# EAGLE design a405-diode-distortion (EAGLE 7.5.1)
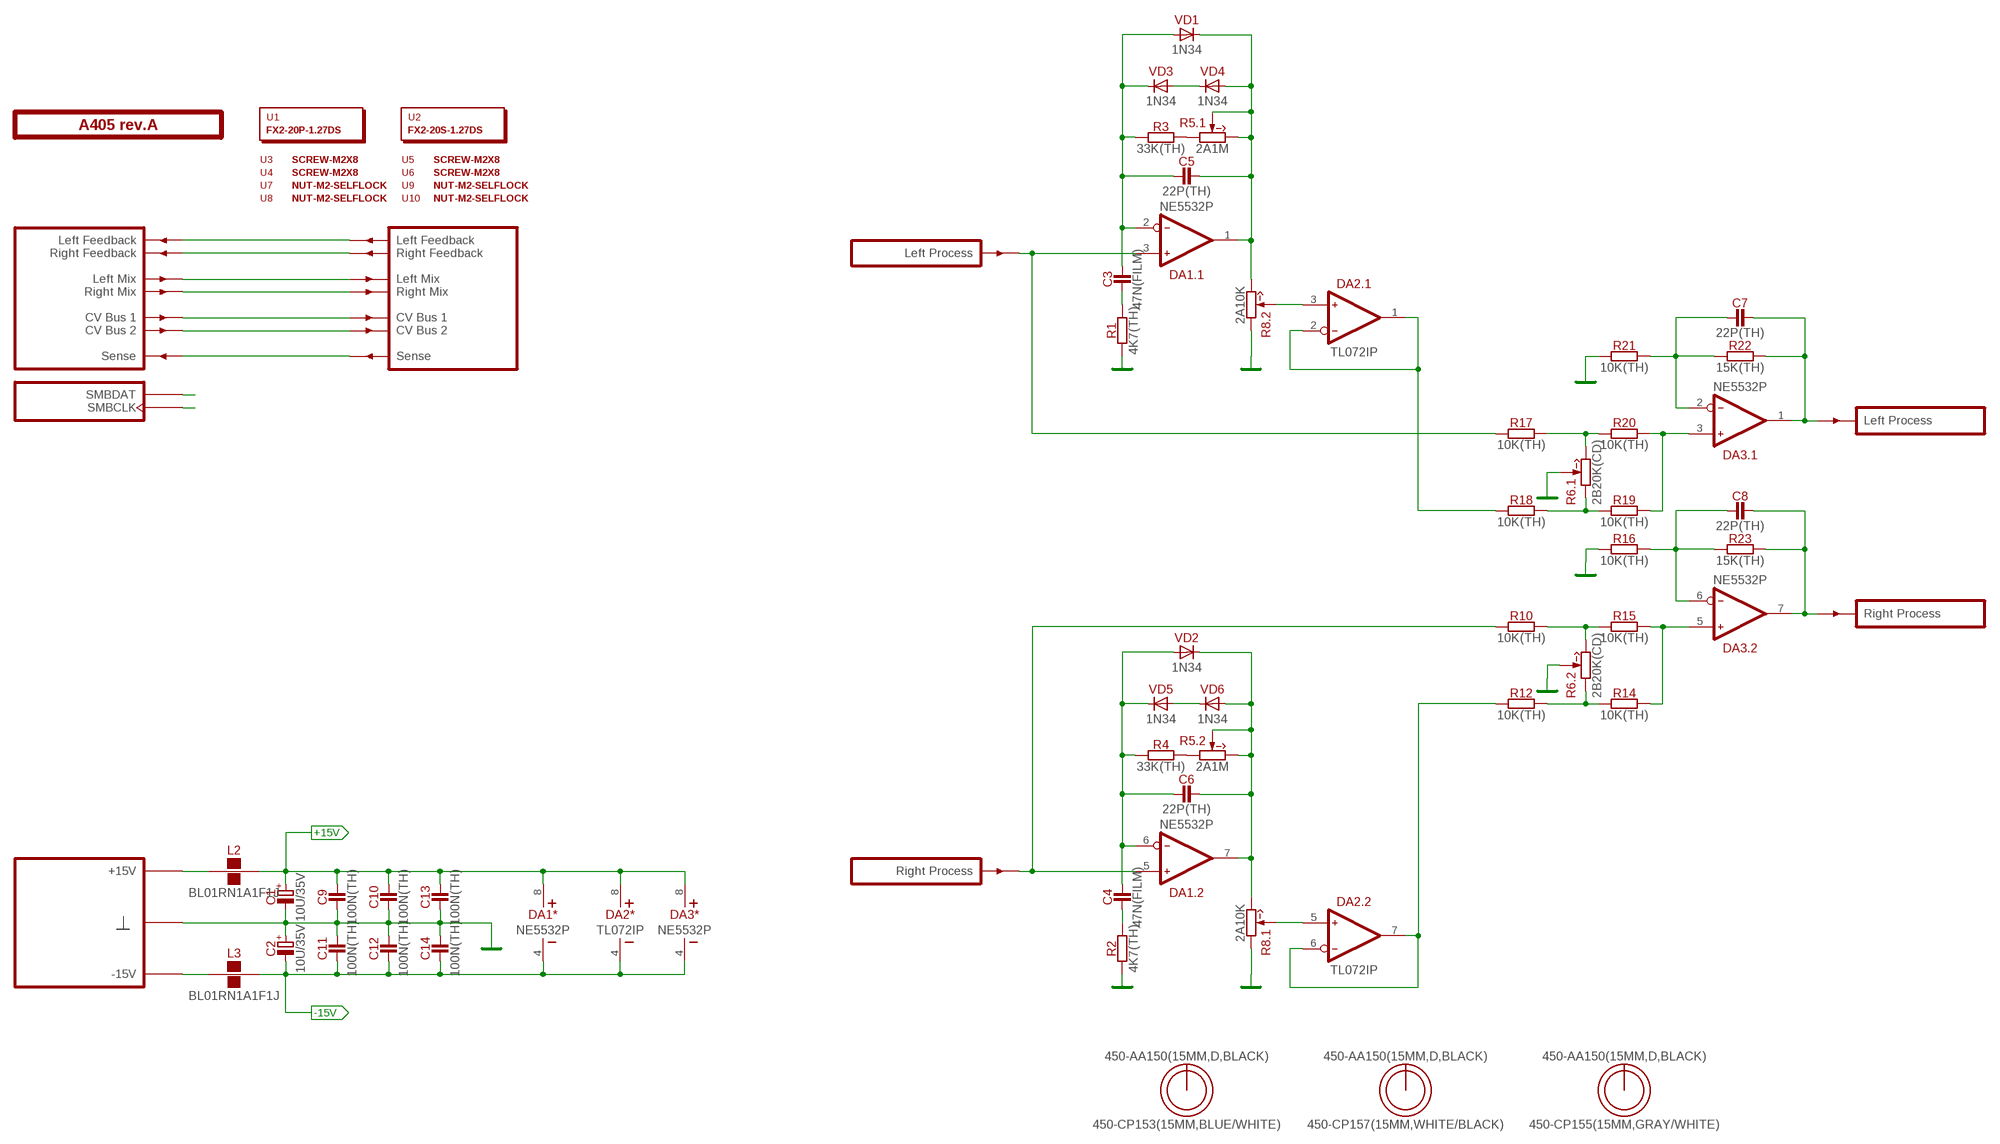
[diagram p0: schematic, sheet 1]

## Parts
C1  10U/35V  [E2-5]
C2  10U/35V  [E2-5]
C3  47N(FILM)  [C050-025X075]
C4  47N(FILM)  [C050-025X075]
C5  22P(TH)  [C050-024X044]
C6  22P(TH)  [C050-024X044]
C7  22P(TH)  [C050-024X044]
C8  22P(TH)  [C050-024X044]
C9  100N(TH)  [C050-024X044]
C10  100N(TH)  [C050-024X044]
C11  100N(TH)  [C050-024X044]
C12  100N(TH)  [C050-024X044]
C13  100N(TH)  [C050-024X044]
C14  100N(TH)  [C050-024X044]
DA1  NE5532P  [DIP-8]
DA2  TL072IP  [DIP-8]
DA3  NE5532P  [DIP-8]
L2  BL01RN1A1F1J  [BL01RN1A]
L3  BL01RN1A1F1J  [BL01RN1A]
O2  450-AA150(15MM,D,BLACK)  [EMPTY]
O3  450-AA150(15MM,D,BLACK)  [EMPTY]
O4  450-AA150(15MM,D,BLACK)  [EMPTY]
O5  450-CP155(15MM,GRAY/WHITE)  [EMPTY]
O6  450-CP157(15MM,WHITE/BLACK)  [EMPTY]
O7  450-CP153(15MM,BLUE/WHITE)  [EMPTY]
PCB1  A405 rev.A  ST2-BOARD-50  [ST2-BOARD-50]
R1  4K7(TH)  [R-0207/10]
R2  4K7(TH)  [R-0207/10]
R3  33K(TH)  [R-0207/10]
R4  33K(TH)  [R-0207/10]
R5  2A1M  [RV11-DUAL]
R6  2B20K(CD)  [RV11-DUAL]
R8  2A10K  [RV11-DUAL]
R10  10K(TH)  [R-0207/10]
R12  10K(TH)  [R-0207/10]
R14  10K(TH)  [R-0207/10]
R15  10K(TH)  [R-0207/10]
R16  10K(TH)  [R-0207/10]
R17  10K(TH)  [R-0207/10]
R18  10K(TH)  [R-0207/10]
R19  10K(TH)  [R-0207/10]
R20  10K(TH)  [R-0207/10]
R21  10K(TH)  [R-0207/10]
R22  15K(TH)  [R-0207/10]
R23  15K(TH)  [R-0207/10]
U1  FX2-20P-1.27DS  [EMPTY]
U2  FX2-20S-1.27DS  [EMPTY]
U3  SCREW-M2X8  [EMPTY]
U4  SCREW-M2X8  [EMPTY]
U5  SCREW-M2X8  [EMPTY]
U6  SCREW-M2X8  [EMPTY]
U7  NUT-M2-SELFLOCK  [EMPTY]
U8  NUT-M2-SELFLOCK  [EMPTY]
U9  NUT-M2-SELFLOCK  [EMPTY]
U10  NUT-M2-SELFLOCK  [EMPTY]
VD1  1N34  [DO35-15]
VD2  1N34  [DO35-15]
VD3  1N34  [DO35-15]
VD4  1N34  [DO35-15]
VD5  1N34  [DO35-15]
VD6  1N34  [DO35-15]

## Nets
+15V [power]: C1.+ C9.2 C10.2 C13.2 DA1.8(*:V+) DA2.8(*:V+) DA3.8(*:V+) L2.2
-15V [power]: C2.- C11.1 C12.1 C14.1 DA1.4(*:V-) DA2.4(*:V-) DA3.4(*:V-) L3.2
FBK_LEFT: PCB1.ALFBK'(LFBK') PCB1.ALFBK(LFBK)
FBK_RIGHT: PCB1.ARFBK'(RFBK') PCB1.ARFBK(RFBK)
GND: C1.- C2.+ C9.1 C10.1 C11.2 C12.2 C13.1 C14.2 PCB1.B4'(GND) PCB1.B4(GND) PCB1.B5'(GND) PCB1.B5(GND) PCB1.B6'(GND) PCB1.B6(GND) PCB1.B7'(GND) PCB1.B7(GND) PCB1.B8'(GND) PCB1.B8(GND) R1.1 R2.1 R6.2'(.2:W) R6.2(.1:W) R8.1'(.2:CCW) R8.1(.1:CCW) R16.1 R21.1
LMIX: PCB1.ALMIX'(LMIX') PCB1.ALMIX(LMIX)
N$1: R3.2 R5.1(.1:CCW)
N$2: R4.2 R5.1'(.2:CCW)
N$3: C7.2 DA3.1(.1:OUT) PCB1.BOUTL'(OUTL) R22.2
N$4: C3.1 R1.2
N$5: R6.3(.1:CW) R17.2 R20.1
N$6: DA1.5(.2:IN+) PCB1.BINR(INR) R10.1
N$7: C6.2 DA1.7(.2:OUT) R5.2'(.2:W) R5.3'(.2:CW) R8.3(.1:CW) VD2.C VD6.A
N$8: C4.1 R2.2
N$9: C5.2 DA1.1(.1:OUT) R5.2(.1:W) R5.3(.1:CW) R8.3'(.2:CW) VD1.C VD4.A
N$10: C4.2 C6.1 DA1.6(.2:IN-) R4.1 VD2.A VD5.C
N$11: C8.1 DA3.6(.2:IN-) R16.2 R23.1
N$12: DA3.5(.2:IN+) R14.2 R15.2
N$13: DA3.3(.1:IN+) R19.2 R20.2
N$14: VD3.A VD4.C
N$15: R6.1'(.2:CCW) R12.2 R14.1
N$16: PCB1.BSENSE'(SENSE') PCB1.BSENSE(SENSE)
N$17: C3.2 C5.1 DA1.2(.1:IN-) R3.1 VD1.A VD3.C
N$18: DA1.3(.1:IN+) PCB1.BINL(INL) R17.1
N$19: C8.2 DA3.7(.2:OUT) PCB1.BOUTR'(OUTR) R23.2
N$20: VD5.A VD6.C
N$23: DA2.5(.2:IN+) R8.2(.1:W)
N$24: DA2.6(.2:IN-) DA2.7(.2:OUT) R12.1
N$26: DA2.3(.1:IN+) R8.2'(.2:W)
N$27: DA2.1(.1:OUT) DA2.2(.1:IN-) R18.1
N$36: L3.1 PCB1.A-15'(P-15V) PCB1.A-15(P-15V) PCB1.B-15'(P-15V) PCB1.B-15(P-15V)
N$38: PCB1.ASMBDAT'(SMBDAT) PCB1.ASMBDAT(SMBDAT)
N$41: PCB1.ACV1'(CV1') PCB1.ACV1(CV1)
N$42: PCB1.ACV2'(CV2') PCB1.ACV2(CV2)
N$43: PCB1.ASMBCLK'(SMBCLK) PCB1.ASMBCLK(SMBCLK)
N$50: R6.1(.1:CCW) R18.2 R19.1
N$59: R6.3'(.2:CW) R10.2 R15.1
N$64: C7.1 DA3.2(.1:IN-) R21.2 R22.1
P+15V: L2.1 PCB1.A+15'(P+15V) PCB1.A+15(P+15V) PCB1.B+15'(P+15V) PCB1.B+15(P+15V)
RMIX: PCB1.ARMIX'(RMIX') PCB1.ARMIX(RMIX)

## Library data of the parts
C1 C2 = capacitors-electrolytic:?; MOUSER: 647-USW1V100MDD
C3 C4 = capacitors:?; MOUSER: 871-B32529C1473J
C5-C8 = capacitors:?
C9-C14 = capacitors:?; MOUSER: 81-RCER71H104K0A2H3B
DA1 DA3 = ic-ti:NE5532; MOUSER: 595-SA5532AP
DA2 = ic-ti:TL072; MOUSER: 595-TL072IP
L2 L3 = inductors:BL01RN1A?; MOUSER: 81-BL01RN1A1F1J
O2-O4 = hardware:450-AA?; MOUSER: 450-AA150
O5 = hardware:450-C?; MOUSER: 450-CP155
O6 = hardware:450-C?; MOUSER: 450-CP157
O7 = hardware:450-C?; MOUSER: 450-CP153
PCB1 = module-footprints:ST2-BOARD-?
R1-R4 R22 R23 = resistors:?
R5 = potentiometers:2**?; MOUSER: 317-2102F-1M
R6 = potentiometers:2**?; MOUSER: 688-RK12L1230C1M
R8 = potentiometers:2**?; MOUSER: 688-RK12L12C0A0E
R10 R12 R14-R21 = resistors:?; MOUSER: 71-RN55D-F-10K
U1 = hardware:?; MOUSER: 798-FX2-20P-1.27DS71
U2 = hardware:?; MOUSER: 798-FX2-20S-1.27DS71
U3-U10 = hardware:*?
VD1-VD6 = diodes:?

## Board
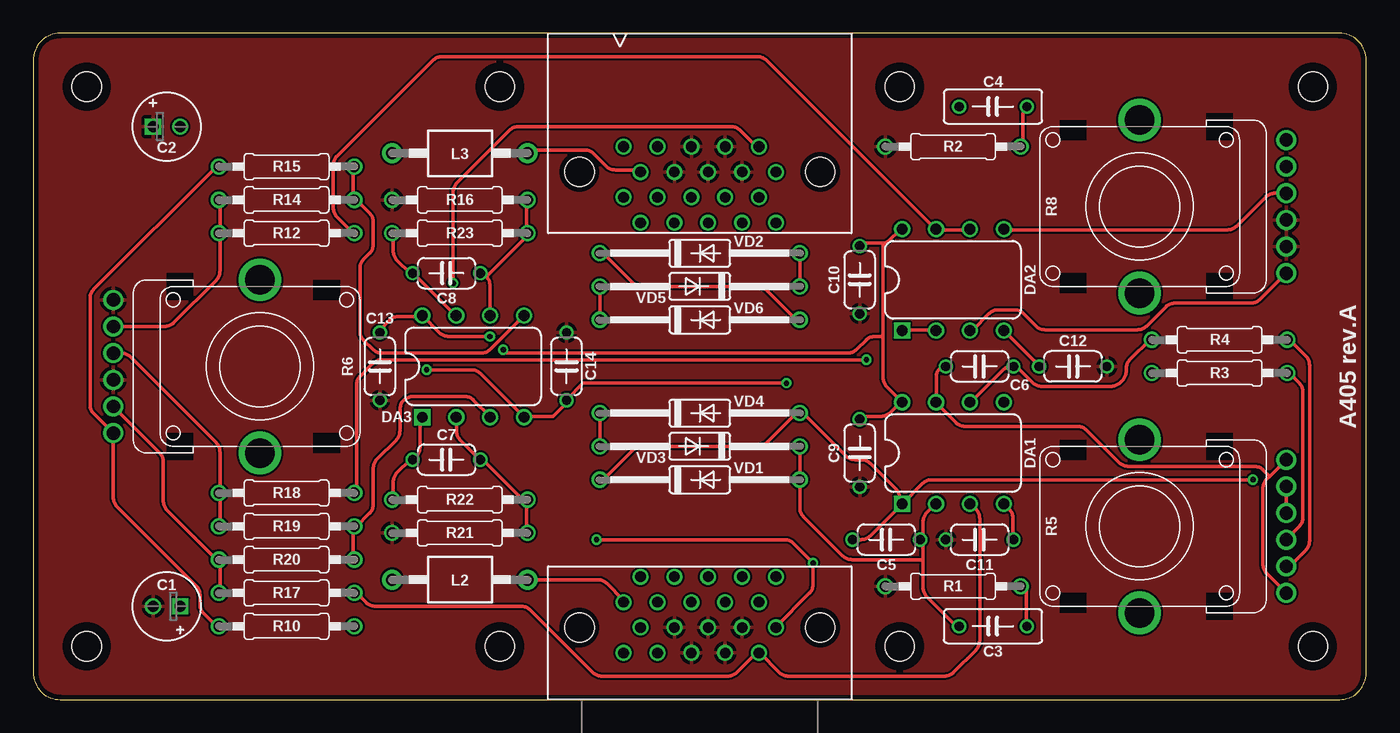
[diagram p1: board, top side]
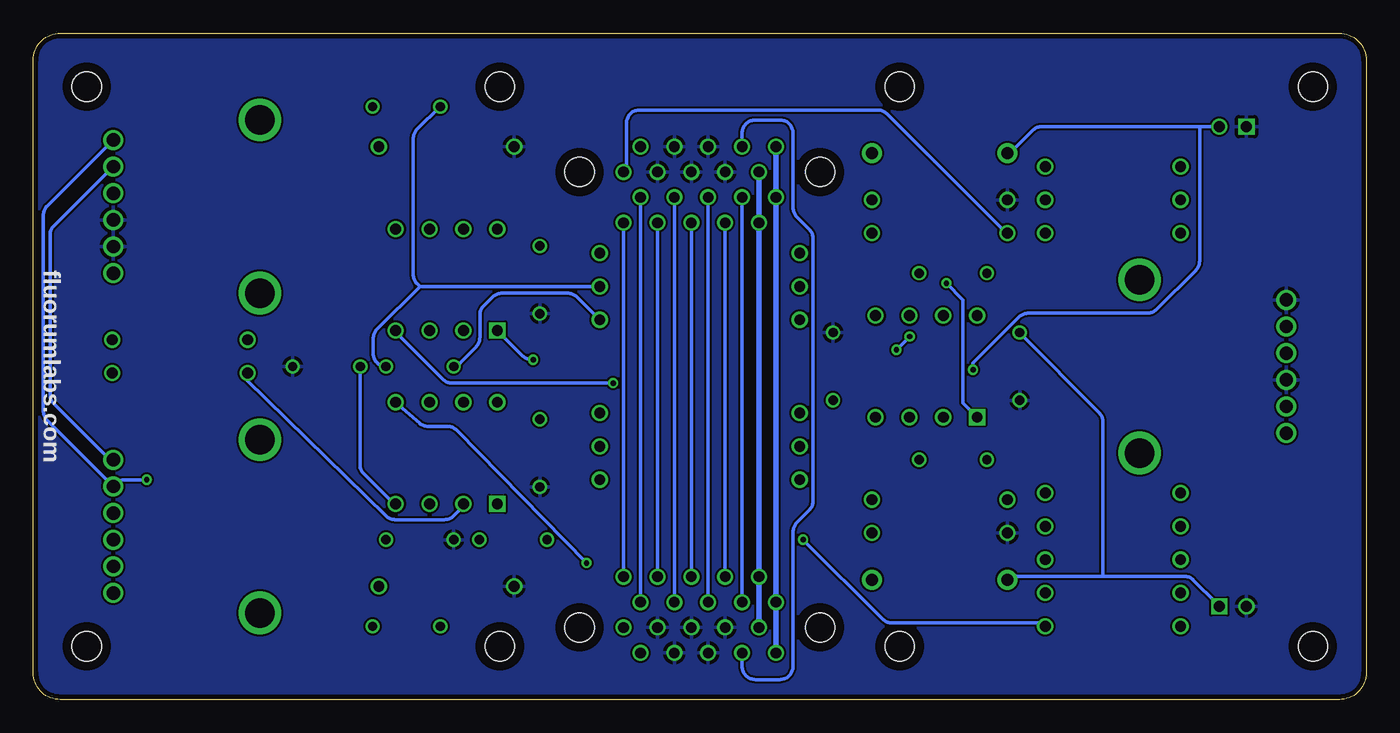
[diagram p2: board, bottom side, seen from below]

Size 100 x 50 mm. Coordinates in mm from the lower left corner, seen from the top.
Outline: 0,48 0,2 arc90 2,0 98,0 arc90 100,2 100,48 arc90 98,50 2,50 arc90 0,48
Copper layers (1*16): Top 0.0356mm / dielectric 1.5011mm / Bottom 0.0356mm
Design rules "sonictrain": minimum track width 6mil, minimum drill 13mil, track to track 6mil, track to pad 6mil, pad to pad 6mil, via to via 6mil, smd to smd 6mil, copper to edge 15mil, drill to drill 6mil, minimum pad ring 7mil, minimum via ring 7mil, stop-mask expansion 3mil, vias tented up to drill 0mil, thermal gap 10mil

### Footprints (pad centres in the part's own frame; a part is rotated, then mirrored left to right if it is on the bottom)
E2-5 = drill 0.813 square: + -1.016,0 | drill 0.813: - 1.016,0
C050-025X075 = drill 0.7: 1 -2.54,0; 2 2.54,0
C050-024X044 = drill 0.7: 1 -2.54,0; 2 2.54,0
DIP-8 = drill 0.813 square: 1 -3.81,-3.81 | drill 0.813: 2 -1.27,-3.81; 3 1.27,-3.81; 4 3.81,-3.81; 5 3.81,3.81; 6 1.27,3.81; 7 -1.27,3.81; 8 -3.81,3.81
BL01RN1A = drill 0.9 pad 1.5: 1 -5.08,0; 2 5.08,0
ST2-BOARD-50 = drill 0.8: A+15 44.285,7.31; A+15' 44.285,37.69; A-15 45.555,9.215; A-15' 45.555,35.785; ACV1 51.905,7.31; ACV1' 51.905,37.69; ACV2 53.175,9.215; ACV2' 53.175,35.785; ALFBK 49.365,7.31; ALFBK' 49.365,37.69; ALMIX 46.825,7.31; ALMIX' 46.825,37.69; ARFBK 50.635,9.215; ARFBK' 50.635,35.785; ARMIX 48.095,9.215; ARMIX' 48.095,35.785; ASMBCLK 55.715,9.215; ASMBCLK' 55.715,35.785; ASMBDAT 54.445,7.31; ASMBDAT' 54.445,37.69; B4 48.095,5.405; B4' 48.095,39.595; B5 49.365,3.5; B5' 49.365,41.5; B6 50.635,5.405; B6' 50.635,39.595; B7 51.905,3.5; B7' 51.905,41.5; B8 53.175,5.405; B8' 53.175,39.595; B+15 44.285,3.5; B+15' 44.285,41.5; B-15 45.555,5.405; B-15' 45.555,39.595; BINL 54.445,3.5; BINR 55.715,5.405; BOUTL' 54.445,41.5; BOUTR' 55.715,39.595; BSENSE 46.825,3.5; BSENSE' 46.825,41.5 | hole 2.2: 4,4; 4,46; 96,4; 96,46; 35,46; 65,46; 65,4; 35,4; 59.025,5.405; 40.975,5.405; 40.975,39.595; 59.025,39.595
R-0207/10 = drill 0.813: 1 -5.08,0; 2 5.08,0
RV11-DUAL = drill 1: 1 -1,-11; 1' -3,-11; 2 1,-11; 2' -5,-11; 3 3,-11; 3' 5,-11 | drill 2.2: S1 -6.5,0; S2 6.5,0
DO35-15 = drill 0.813: A 7.5,0; C -7.5,0

### Placement (x,y rotation side)
C1  10,7 180 top
C2  10,43 0 top
C3  72,5.5 180 top
C4  72,44.5 180 top
C5  64,12 180 top
C6  71,25 180 top
C7  31,18 180 top
C8  31,32 180 top
C9  62,18.5 90 top
C10  62,31.5 90 top
C11  71,12 180 top
C12  78,25 0 top
C13  26,25 90 top
C14  40,25 90 top
DA1  69,18.5 0 top
DA2  69,31.5 0 top
DA3  33,25 0 top
L2  32,9 180 top
L3  32,41 180 top
O2  -8,-100.25 0 top  (outside the outline)
O3  -9,-101.5 0 top  (outside the outline)
O4  -10,-102.75 0 top  (outside the outline)
O5  -11,-104 0 top  (outside the outline)
O6  -12,-105.25 0 top  (outside the outline)
O7  -13,-106.5 0 top  (outside the outline)
PCB1  0,0 0 top
R1  69,8.5 0 top
R2  69,41.5 0 top
R3  89,24.5 0 top
R4  89,27 0 top
R5  2*A1M  [RV11-DUAL]  83,13 90 top
R6  2*B20K(CD)  [RV11-DUAL]  17,25 270 top
R8  2*A10K  [RV11-DUAL]  83,37 90 top
R10  19,5.5 180 top
R12  19,35 180 top
R14  19,37.5 0 top
R15  19,40 0 top
R16  32,37.5 0 top
R17  19,8 180 top
R18  19,15.5 180 top
R19  19,13 0 top
R20  19,10.5 0 top
R21  32,12.5 0 top
R22  32,15 180 top
R23  32,35 180 top
U1  83,-99 0 top  (outside the outline)
U2  86,-99 0 top  (outside the outline)
U3  -14,-107.75 0 top  (outside the outline)
U4  -15,-109 0 top  (outside the outline)
U5  -16,-110.25 0 top  (outside the outline)
U6  -17,-111.5 0 top  (outside the outline)
U7  -18,-112.75 0 top  (outside the outline)
U8  -19,-114 0 top  (outside the outline)
U9  -20,-115.25 0 top  (outside the outline)
U10  -21,-116.5 0 top  (outside the outline)
VD1  50,16.5 0 top
VD2  50,33.5 0 top
VD3  50,19 180 top
VD4  50,21.5 0 top
VD5  50,31 180 top
VD6  50,28.5 0 top

### Tracks (layer width: path | path; a pad name or v marks a point on that pad's centre or on a via)
+15V  (via drill 0.4)
  Top 0.254: 63.75,34.25 arc45 64.18,34.43 65,35.25 DA2.8 | 63.75,34.25 62,34.25 C10.2 | C9.2 62,21.25 63.59,21.25 arc45 64.29,21.54 65,22.25 DA1.8 64.04,23.46 arc-45 63.75,24.16 63.75,27.25 | C13.2 26,27.75 26.71,28.46 arc-45 27.41,28.75 29,28.75 DA3.8 30.46,27.54 arc45 31.16,27.25 v34.25,27.25 | 63.75,34.25 63.75,27.25 | 63.75,27.25 63.16,27.25 arc45 62.46,26.96 61.79,26.29 arc-45 61.09,26 35.5,26 v35.25,26.25
  Bottom 0.254: L2.2 26.75,9 26.5,9.25 19.75,9.25 | 19.75,9.25 13.66,9.25 arc45 12.96,8.96 11.25,7.25 C1.+ | v34.25,27.25 v35.25,26.25 | 19.75,9.25 19.75,20.84 arc-45 20.04,21.54 26,27.5 C13.2
-15V  (via drill 0.4)
  Top 0.254: DA1.4 73.21,14.29 arc-45 73.5,13.59 73.5,12 C11.1 | DA2.4 75.25,25.25 75.25,25 C12.1 | v56.5,23.75 41.25,23.75 40,22.5 C14.1 40,22.25 39,21.25 37,21.25 DA3.4 33.54,24.46 arc45 32.84,24.75 v29.5,24.75
  Bottom 0.254: DA1.4 73,14.75 75.21,16.96 arc45 75.5,17.66 75.5,25 C12.1 | 12.5,43 24.34,43 arc-45 25.04,42.71 26.75,41 L3.2 | 12.5,43 C2.- | v56.5,23.75 68.59,23.75 arc45 69.29,24.04 72.75,27.5 DA2.4 | v29.5,24.75 29.5,25.25 26.04,28.71 arc45 25.34,29 16.41,29 arc-45 15.71,29.29 12.79,32.21 arc-45 12.5,32.91 12.5,43
FBK_LEFT
  Bottom 0.254: PCB1.ALFBK' PCB1.ALFBK
FBK_RIGHT
  Bottom 0.254: PCB1.ARFBK PCB1.ARFBK'
GND
  pour Bottom: 98,0 2,0 arc-90 0,2 0,48 arc-90 2,50 98,50 arc-90 100,48 100,2 arc-90
  pour Top: 98,0 2,0 arc-90 0,2 0,48 arc-90 2,50 98,50 arc-90 100,48 100,2 arc-90
LMIX
  Bottom 0.254: PCB1.ALMIX' PCB1.ALMIX
N$1
  Top 0.254: R5.1 94.96,12.96 arc45 95.25,13.66 95.25,23.09 arc45 94.96,23.79 94.25,24.5 R3.2
N$2
  Top 0.254: R5.1' 94.25,10 95.46,11.21 arc45 95.75,11.91 95.75,25.09 arc45 95.46,25.79 94.25,27 R4.2
N$3  (via drill 0.4)
  Top 0.254: DA3.1 29,21 29,18.91 arc-45 28.71,18.21 28.5,18 C7.2 28.25,18 27.29,17.04 arc45 27,16.34 27,15 R22.2 | v31.5,31.25 31.5,38.09 arc-45 31.79,38.79 35.71,42.71 arc-45 36.41,43 52.34,43 arc-45 53.04,42.71 54.25,41.5 PCB1.BOUTL'
  Bottom 0.254: v31.5,31.25 30.25,30 30.25,22.25 DA3.1
N$4
  Top 0.254: C3.1 74.5,5.5 74.5,8.25 74.25,8.5 R1.2
N$5
  Top 0.254: R17.2 14,8 14,10.5 R20.1 13.75,10.5 10.04,14.21 arc-45 9.75,14.91 9.75,17.84 arc45 9.46,18.54 R6.3
N$6  (via drill 0.4)
  Top 0.254: PCB1.BINR 55.75,5.5 58.21,7.96 arc45 58.5,8.66 v58.5,10.25 57.04,11.71 arc45 56.34,12 v42.25,12
  Bottom 0.254: v58.5,10.25 68.21,20.2 arc-46 68.92,20.5 70.37,20.5 arc41 71.03,20.75 DA1.5 | v42.25,12 36.29,6.04 arc-45 35.59,5.75 24.5,5.75 24.25,5.5 R10.1
N$7
  Top 0.254: C6.2 arc90 67.75,24.29 67.75,22.5 DA1.7 67.75,22.25 69.21,20.79 arc45 69.91,20.5 78.34,20.5 arc-45 79.04,20.21 81.46,17.79 arc45 82.16,17.5 91.59,17.5 arc-45 92.29,17.21 92.75,16.75 | R5.2' 92.54,9.46 arc-45 92.25,10.16 92.25,15.84 arc-45 92.54,16.54 92.75,16.75 | R5.3' 92.75,16.75 | VD2.C 42.75,33.5 44.96,31.29 arc45 45.66,31 54.34,31 arc-45 55.04,30.71 57.25,28.5 VD6.A
  Bottom 0.254: R8.3 98.46,35.54 arc-45 98.75,34.84 98.75,22.91 arc-45 98.46,22.21 94.25,18 R5.3' | VD6.A 59.21,30.21 arc-45 59.91,30.5 64.84,30.5 arc-45 65.54,30.21 66.21,29.54 arc-45 66.5,28.84 66.5,27.16 arc45 66.79,26.46 68.25,25 C6.2
N$8
  Top 0.254: R2.2 74.25,41.5 74.25,43.9 arc-45 74.5,44.5 C4.1
N$9  (via drill 0.4)
  Top 0.254: DA1.1 62.79,12.29 arc-45 62.09,12 C5.2 | R5.2 R5.3 | DA1.1 65,14.75 65,15.09 arc45 64.71,15.79 62.79,17.71 arc45 62.09,18 61.66,18 arc-45 60.96,18.29 57.75,21.5 VD4.A 57.25,21.5 55.04,19.29 arc-45 54.34,19 45.66,19 arc45 44.96,18.71 42.75,16.5 VD1.C | DA1.1 66.71,16.21 arc-45 67.41,16.5 v91.5,16.5
  Bottom 0.254: R8.3' 98.96,37.04 arc-45 99.25,36.34 99.25,21.66 arc-45 98.96,20.96 R5.3 93.79,16.21 arc45 93.09,16.5 v91.5,16.5
N$10
  Top 0.254: DA1.6 70.5,22.5 72.71,24.71 arc-45 73.41,25 C6.1 73.75,25 74.96,23.79 arc45 75.66,23.5 80.84,23.5 arc45 81.54,23.79 81.71,23.96 arc45 82,24.66 82,24.84 arc-45 82.29,25.54 83.75,27 R4.1 | VD2.A VD5.C
  Bottom 0.254: C6.1 arc90 74.5,25.96 74.5,27.09 arc45 74.21,27.79 71,31 | VD5.C 71,31 | 71,31 71.21,31.21 arc45 71.5,31.91 71.5,42.09 arc45 71.21,42.79 69.5,44.5 C4.2
N$11
  Top 0.254: 34,31.75 arc-45 34.25,31.15 34.25,29 DA3.6 | 34,31.75 33.75,32 C8.1 34,31.75 | 34,31.75 37.25,35 R23.1 37,35 37,37.5 R16.2
N$12
  Top 0.254: R15.2 24,40 24,37.5 R14.2 24.25,37.5 25.21,36.54 arc-45 25.5,35.84 25.5,34.16 arc-45 25.21,33.46 24.79,33.04 arc45 24.5,32.34 24.5,27.66 arc45 24.79,26.96 25.46,26.29 arc45 26.16,26 33.59,26 arc45 34.29,26.29 DA3.5
N$13
  Top 0.254: R20.2 24,10.5 24,13 R19.2 24.25,13 25.21,13.96 arc45 25.5,14.66 25.5,17.34 arc-45 25.79,18.04 27.21,19.46 arc45 27.5,20.16 27.5,21.75 arc-90 28.5,22.75 32.34,22.75 arc-45 33.04,22.46 34.25,21.25 DA3.3
N$14
  Top 0.254: VD4.C VD3.A
N$15
  Top 0.254: R14.1 14,37.5 14,35 | R6.1' 9.84,28 arc45 10.54,28.29 13.71,31.46 arc45 14,32.16 14,35 | 14,35 R12.2
N$16
  Bottom 0.254: PCB1.BSENSE 46.83,2.5 arc-90 45.83,1.5 44,1.5 arc-90 43,2.5 43,12.59 arc45 42.71,13.29 41.79,14.21 arc-45 41.5,14.91 41.5,34.59 arc-45 41.79,35.29 42.71,36.21 arc45 43,36.91 43,42.5 arc-90 44,43.5 45.83,43.5 arc-90 46.83,42.5 PCB1.BSENSE'
N$17
  Top 0.254: 66.75,12 66.75,13.34 arc-45 67.04,14.04 67.5,14.5 DA1.2 | 66.75,10.5 66.75,8.41 arc45 67.04,7.71 69.25,5.5 C3.2 | 66.75,10.5 66.75,12 | 66.75,12 C5.1 | VD3.C VD1.A 57.5,14.41 arc45 57.79,13.71 60.71,10.79 arc45 61.41,10.5 66.75,10.5
  Bottom 0.254: DA1.2 67.75,14.5 68.46,13.79 arc45 69.16,13.5 72.84,13.5 arc44 73.54,13.79 84,24 R3.1
N$18
  Top 0.254: DA1.3 70.5,14.5 70.71,14.29 arc-45 71,13.59 71,4.41 arc-45 70.71,3.71 69.04,2.04 arc-45 68.34,1.75 56.66,1.75 arc-45 55.96,2.04 54.5,3.5 PCB1.BINL 54.25,3.5 52.79,2.04 arc-45 52.09,1.75 42.66,1.75 arc-45 41.96,2.04 37.29,6.71 arc45 36.59,7 25.66,7 arc-45 24.96,7.29 24.25,8 R17.1
N$19
  Top 0.254: DA3.7 31.5,29 28.5,32 C8.2 28.25,32 27.29,32.96 arc-45 27,33.66 27,35 R23.2
  Bottom 0.254: R23.2 27,35 35.96,43.96 arc-45 36.66,44.25 54.5,44.25 arc-90 55.5,43.25 55.5,39.75 PCB1.BOUTR'
N$20
  Top 0.254: VD6.C VD5.A
N$23
  Top 0.254: DA2.5 73,35.25 89.59,35.25 arc45 90.29,35.54 92.46,37.71 arc-45 93.16,38 R8.2
N$24
  Top 0.254: DA2.6 70.25,35.25 67.75,35.25 DA2.7 67.5,35.5 55.05,47.94 arc46 54.32,48.25 30.66,48.25 arc45 29.96,47.96 22.79,40.79 arc45 22.5,40.09 22.5,36.91 arc45 22.79,36.21 24,35 R12.1
N$26
  Top 0.254: R8.2' 92.04,30.04 arc-45 91.34,29.75 85.66,29.75 arc45 84.96,29.46 83.54,28.04 arc-45 82.84,27.75 75.91,27.75 arc-45 75.21,28.04 74.29,28.96 arc45 73.59,29.25 72.41,29.25 arc45 71.71,28.96 70.5,27.75 DA2.3
N$27  (via drill 0.4)
  Top 0.254: DA2.2 67.5,27.75 65.25,27.75 DA2.1 | R18.1 24.25,15.5 24.25,23.59 arc-45 24.54,24.29 25.46,25.21 arc-45 26.16,25.5 v62.5,25.5
  Bottom 0.254: DA2.1 63.29,25.79 arc-45 62.59,25.5 v62.5,25.5
N$36
  Top 0.254: L3.1 37.25,41 37.5,41.25 41.34,41.25 arc-45 42.04,40.96 42.96,40.04 arc45 43.66,39.75 45.5,39.75 PCB1.B-15'
  Bottom 0.406: PCB1.B-15 PCB1.A-15 PCB1.A-15' PCB1.B-15'
N$38
  Bottom 0.254: PCB1.ASMBDAT' PCB1.ASMBDAT
N$41
  Bottom 0.254: PCB1.ACV1' PCB1.ACV1
N$42
  Bottom 0.254: PCB1.ACV2 PCB1.ACV2'
N$43
  Bottom 0.254: PCB1.ASMBCLK PCB1.ASMBCLK'
N$50
  Top 0.254: 14,15.5 14,13 R19.1 | R6.1 6.59,26 arc-45 7.29,25.71 13.71,19.29 arc-45 14,18.59 14,15.5 | 14,15.5 R18.2
N$59
  Top 0.254: R10.2 13.75,5.5 12.79,6.46 arc-45 12.5,7.16 12.5,7.84 arc45 12.21,8.54 6.29,14.46 arc-45 6,15.16 R6.3' 4.54,21.46 arc-45 4.25,22.16 4.25,30.09 arc-45 4.54,30.79 13.75,40 R15.1
N$64
  Top 0.254: DA3.2 31.75,21 31.75,20.16 arc45 32.04,19.46 33.5,18 C7.1 33.75,18 36.75,15 37,15 | 37,15 R22.1 | 37,15 37,12.5 R21.2
P+15V
  Top 0.254: L2.1 42.34,9 arc-45 43.04,8.71 44.25,7.5 PCB1.A+15
  Bottom 0.406: PCB1.B+15 PCB1.A+15 PCB1.A+15' PCB1.B+15'
RMIX
  Bottom 0.254: PCB1.ARMIX PCB1.ARMIX'